# EAGLE design PCB Design Circuit (EAGLE 9.6.2)
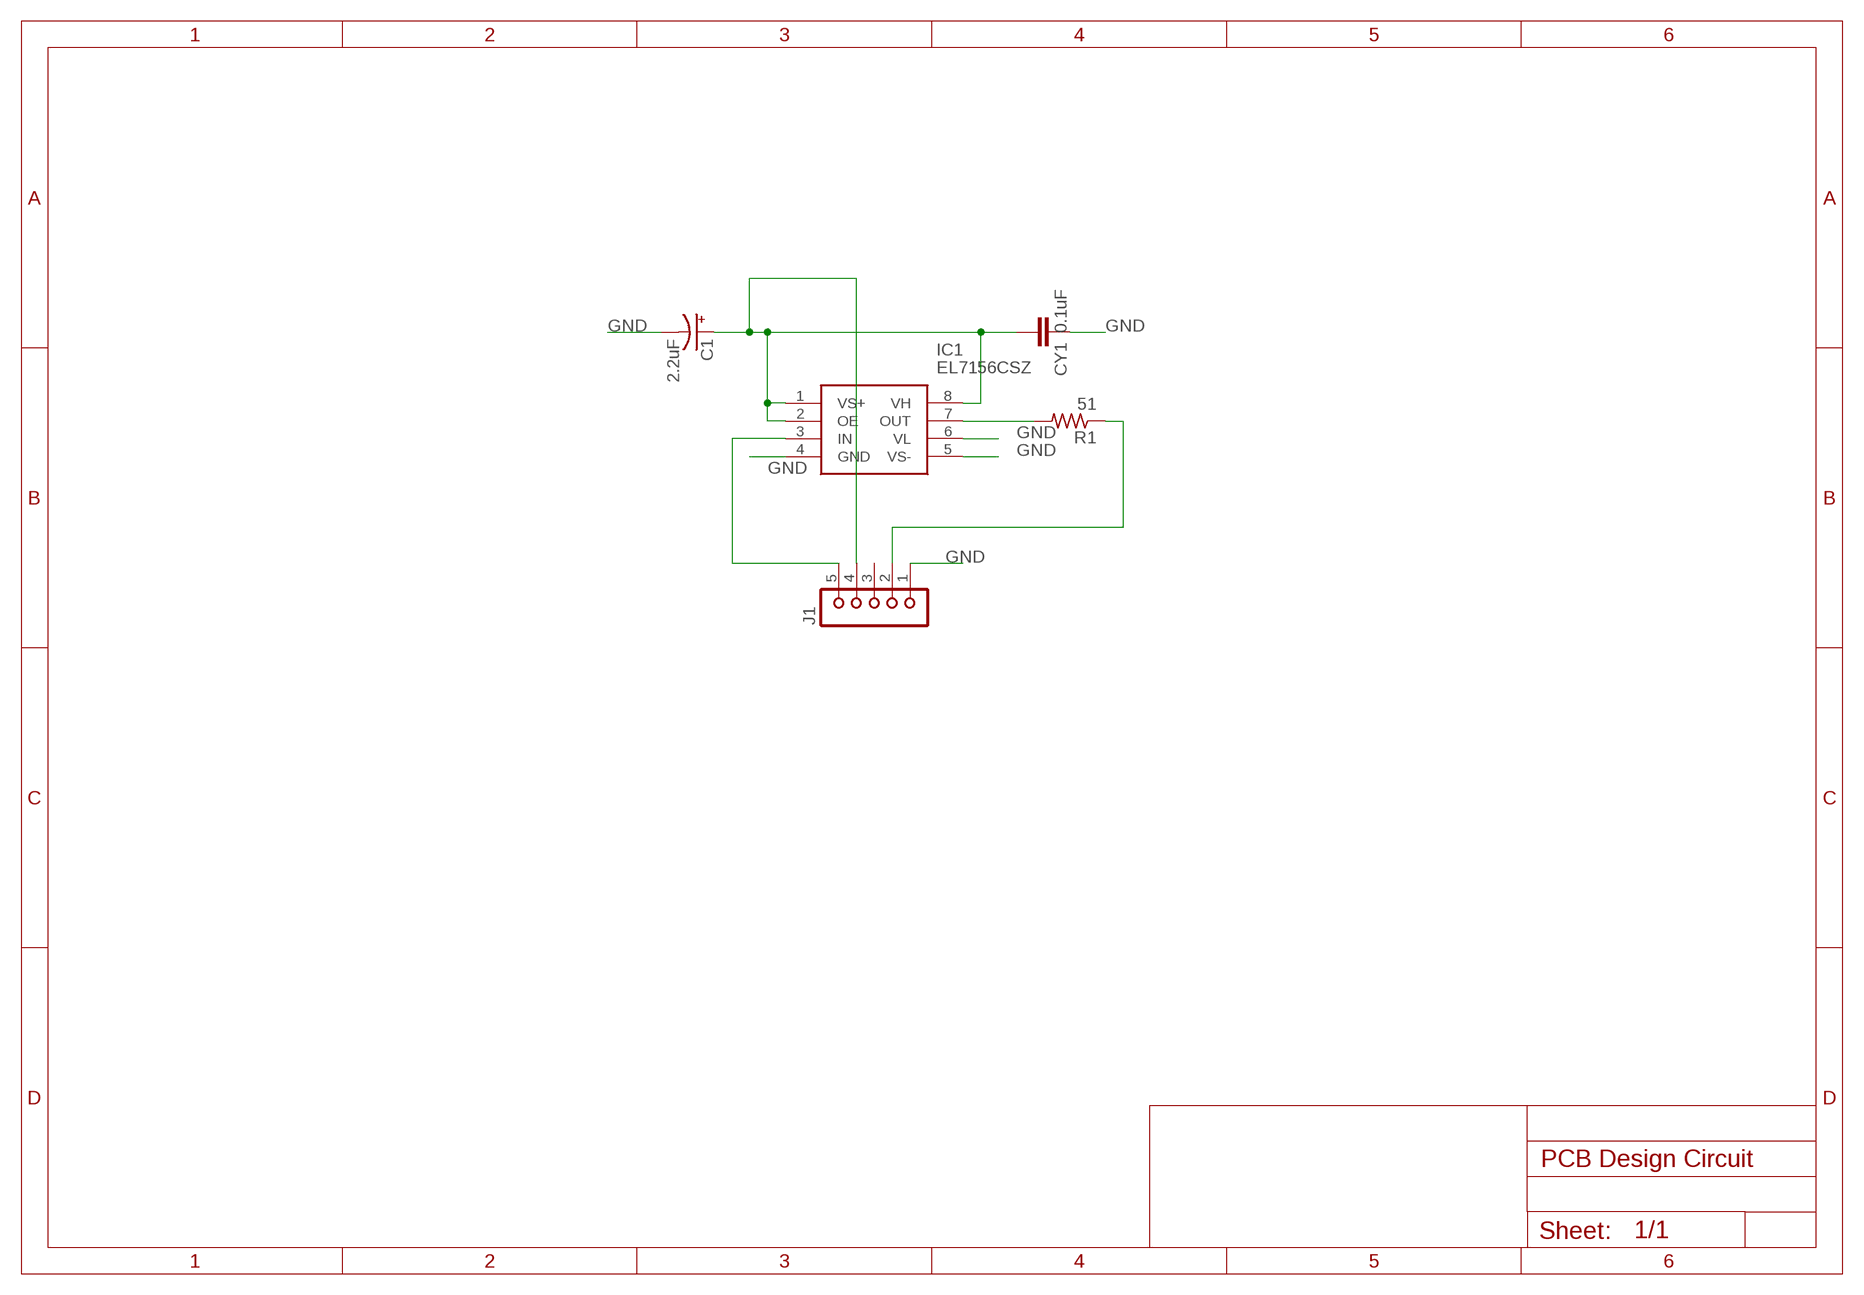
[diagram p0: schematic, sheet 1]

## Parts
C1  2.2uF  CPOL-USE2.5-6  [E2,5-6]
CY1  0.1uF  CYYC7B5  [YC7B5]
IC1  EL7156CSZ  [SOIC127P599X173-8N]
J1  JU05  [JU05]
R1  51  R-US_0207/7  [0207/7]

## Nets
GND: C1.- CY1.1 IC1.4(GND) IC1.5(VS-) IC1.6(VL) J1.1
N$1: IC1.3(IN) J1.5
N$2: IC1.7(OUT) R1.2
N$3: C1.+ CY1.2 IC1.1(VS+) IC1.2(OE) IC1.8(VH) J1.4
N$5: J1.2 R1.1
Unconnected: J1.3

## Library data of the parts
C1 = rcl:CPOL-US: POLARIZED CAPACITOR, American symbol; SPICEPREFIX: C
CY1 = rcl:CY: Y CAPACITOR for power line; SPICEPREFIX: C
IC1 = EL7156CSZ:EL7156CSZ: PowerFet/CCD drivers High Performance Pin Driver Source: Datasheet <https://www.renesas.com/en-us/www/doc/datasheet/el7156.pdf>; DESCRIPTION: PowerFet/CCD drivers High Performance Pin Driver; HEIGHT: 1.727mm; MANUFACTURER_NAME: Renesas Electronics; MANUFACTURER_PART_NUMBER: EL7156CSZ; MOUSER_PART_NUMBER: 968-EL7156CSZ; MOUSER_PRICE-STOCK: https://www.mouser.co.uk/ProductDetail/Renesas-Intersil/EL7156CSZ?qs=cbl4%252BYHJGOEHGkqD%2FU%2FLwg%3D%3D
J1 = con-lsta:JU05: PIN HEADER; OC_FARNELL: unknown; OC_NEWARK: unknown
R1 = rcl:R-US_: RESISTOR, American symbol; SPICEPREFIX: R

## Board
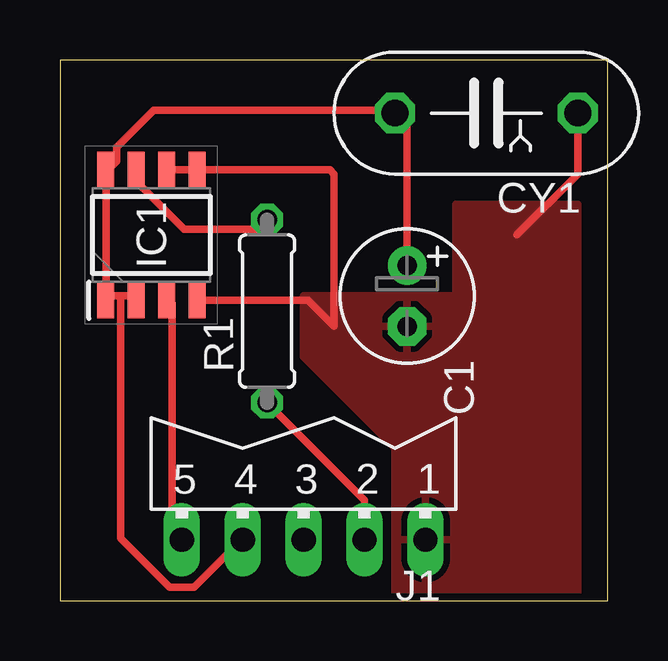
[diagram p1: board, top side]

Size 22.84 x 22.53 mm. Coordinates in mm from the lower left corner, seen from the top.
Outline: 0,0 22.84,0 22.84,22.53 0,22.53 0,0
Copper layers (1*16): Top 0.035mm / dielectric 1.5mm / Bottom 0.035mm
Design rules "elcdrc": minimum track width 12mil, minimum drill 0.3mm, track to track 12mil, track to pad 12mil, pad to pad 12mil, via to via 12mil, smd to smd 6mil, copper to edge 12mil, drill to drill 12mil, minimum pad ring 10mil, minimum via ring 8mil, stop-mask expansion 4mil, vias tented up to drill 0mil, thermal gap 10mil

### Footprints (pad centres in the part's own frame; a part is rotated, then mirrored left to right if it is on the bottom)
E2,5-6 = drill 0.813 pad 1.6: + -1.27,0 | drill 0.813 pad 1.6 octagon: - 1.27,0
YC7B5 = drill 1.118 octagon: 1 -3.81,0; 2 3.81,0
SOIC127P599X173-8N = smd 1.519 x 0.7: 1 -2.716,1.905; 2 -2.716,0.635; 3 -2.716,-0.635; 4 -2.716,-1.905; 5 2.716,-1.905; 6 2.716,-0.635; 7 2.716,0.635; 8 2.716,1.905
JU05 = drill 1.016 long: 1 -5.08,0; 2 -2.54,0; 3 0,0; 4 2.54,0; 5 5.08,0
0207/7 = drill 0.813 octagon: 1 -3.81,0; 2 3.81,0

### Placement (x,y rotation side)
C1  14.48,12.7 270 top
CY1  17.78,20.32 180 top
IC1  3.81,15.24 90 top
J1  10.16,2.54 180 top
R1  8.64,12.06 90 top

### Tracks (layer width: path | path; a pad name or v marks a point on that pad's centre or on a via)
GND
  Top 0.305: IC1.6 IC1.5 11.25,17.96 11.43,17.78 11.43,11.43 10.79,12.06 10.34,12.52 IC1.4 | CY1.1 21.59,17.78 19.05,15.24
  pour Top: 10.16,12.7 16.51,12.7 16.51,16.51 21.59,16.51 21.59,0 13.97,0 13.97,6.35 10.16,10.16
N$1
  Top 0.305: IC1.3 4.67,12.39 4.67,2.95 J1.5
N$2
  Top 0.305: R1.2 8.23,15.47 5.18,15.47 3.17,17.47 IC1.7
N$3
  Top 0.305: 1.93,12.7 IC1.1 | 1.93,12.7 1.93,17.93 IC1.8 1.93,17.88 2.37,18.32 2.37,18.91 3.91,20.44 13.85,20.44 CY1.2 14.48,19.81 C1.+ | IC1.2 3,12.7 2.54,12.7 | 2.54,12.7 1.93,12.7 | 2.54,12.7 2.54,2.59 4.58,0.56 5.58,0.56 7.57,2.54 J1.4
N$5
  Top 0.305: J1.2 12.7,4.19 R1.1